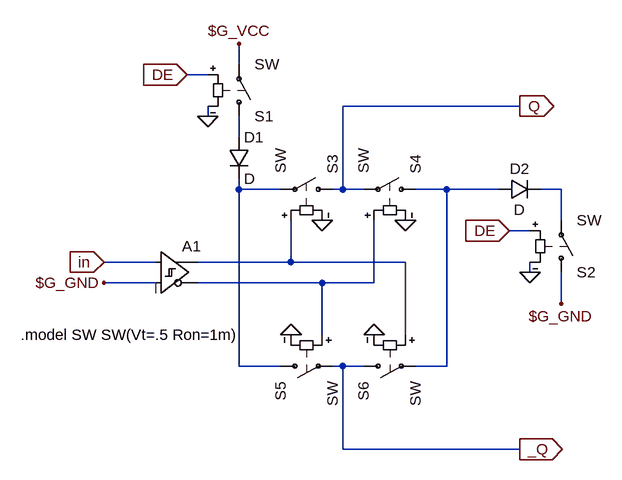
[diagram p0: schematic driver.asc]
driver.asc, the LTspice schematic file:
Version 4
SHEET 1 880 832
WIRE 96 -160 96 -192
WIRE 48 -144 16 -144
WIRE 528 -96 256 -96
WIRE 48 -80 48 -96
WIRE 96 -48 96 -80
WIRE 96 32 96 16
WIRE 160 32 96 32
WIRE 256 32 256 -96
WIRE 256 32 240 32
WIRE 288 32 256 32
WIRE 416 32 368 32
WIRE 496 32 416 32
WIRE 592 32 560 32
WIRE 592 80 592 32
WIRE 544 96 512 96
WIRE -32 144 -112 144
WIRE 176 144 176 80
WIRE 176 144 32 144
WIRE 352 144 176 144
WIRE 544 160 544 144
WIRE -32 176 -112 176
WIRE 224 176 32 176
WIRE 304 176 304 80
WIRE 304 176 224 176
WIRE 592 208 592 160
WIRE 224 256 224 176
WIRE 352 256 352 144
WIRE 96 304 96 32
WIRE 160 304 96 304
WIRE 256 304 240 304
WIRE 288 304 256 304
WIRE 416 304 416 32
WIRE 416 304 368 304
WIRE 256 432 256 304
WIRE 528 432 256 432
FLAG -112 144 in
IOPIN -112 144 In
FLAG 528 -96 Q
IOPIN 528 -96 Out
FLAG 528 432 _Q
IOPIN 528 432 Out
FLAG 16 -144 DE
IOPIN 16 -144 In
FLAG 96 -192 $G_VCC
FLAG 592 208 $G_GND
FLAG -112 176 $G_GND
FLAG 48 -80 0
FLAG 544 160 0
FLAG 512 96 DE
IOPIN 512 96 In
FLAG 224 80 0
FLAG 352 80 0
FLAG 176 256 0
FLAG 304 256 0
SYMBOL sw 96 -64 M180
SYMATTR InstName S1
SYMBOL sw 592 176 M180
SYMATTR InstName S2
SYMBOL Digital\\diffschmitt -32 96 R0
WINDOW 3 8 44 Invisible 2
SYMATTR Value VT=2
SYMATTR InstName A1
SYMBOL sw 256 32 M270
SYMATTR InstName S3
SYMBOL sw 384 32 M270
SYMATTR InstName S4
SYMBOL sw 144 304 M90
SYMATTR InstName S5
SYMBOL sw 272 304 M90
SYMATTR InstName S6
SYMBOL diode 80 -48 R0
SYMATTR InstName D1
SYMBOL diode 496 48 R270
WINDOW 0 32 32 VTop 2
WINDOW 3 0 32 VBottom 2
SYMATTR InstName D2
TEXT -240 256 Left 2 !.model SW SW(Vt=.5 Ron=1m)

The netlist it stands for:
* driver.asc
S1 N001 $G_VCC DE 0 SW
S2 $G_GND N004 DE 0 SW
A1 in $G_GND 0 0 0 N006 N005 0 SCHMITT VT=2
S3 Q N002 N005 0 SW
S4 N003 Q N006 0 SW
S5 N002 _Q N006 0 SW
S6 _Q N003 N005 0 SW
D1 N001 N002 D
D2 N003 N004 D
.model D D
.lib standard.dio
.model SW SW(Vt=.5 Ron=1m)
.backanno
.end